# Altium schematic sheet Sensor.SchDoc: B502EA TH Sensor
size 292 x 193 mm; SheetNumber: 1; SheetTotal: 1
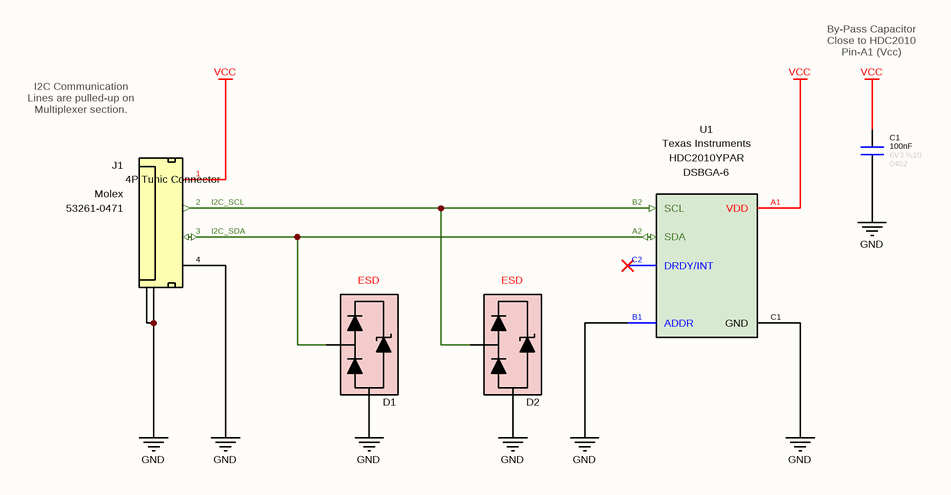
[diagram p0: Sensor.SchDoc]

## Parts
C1  value 100nF  Tolerance: %10  Voltage: 6V3  Case: 0402  [CAPACITOR_0402]  (hidden comment: Capacitor - 100nF [0402] (Ceramic))
D1  0402ESDA-MLP1  [ESD_0402]  (value not drawn)
D2  0402ESDA-MLP1  [ESD_0402]  (value not drawn)
J1  Manufacturer Name: Molex  Manufacturer Part Number: 53261-0471  [Connector_Tunic 4P]  (hidden comment: 4P SMD Tunic Connector)
U1  Manufacturer Name: Texas Instruments  Case: DSBGA-6  [HDC2010]  (hidden comment: HDC2010YPAR)

## Nets
GND: C1.1 D1.2(GND) D2.2(GND) J1.4(Pin-4) J1.5(GND) J1.6(GND) U1.B1(ADDR) U1.C1(GND)
VCC: C1.2 J1.1(Pin-1) U1.A1(VDD)
I2C_SCL: D2.1(I/O) J1.2(Pin-2) U1.B2(SCL)
I2C_SDA: D1.1(I/O) J1.3(Pin-3) U1.A2(SDA)

Not connected (* = marked no-connect by the designer): U1 C2(DRDY/INT)*

## Notes on the sheet
- I2C Communication Lines are pulled-up on Multiplexer section.
- By-Pass Capacitor
  Close to HDC2010
  Pin-A1 (Vcc)
- © 2021 All rights reserved.
  This document may not, in whole or in part, be copied, photocopied, reproduced, translated or converted to any electronic or machine readable from without prior written permission of Mehmet Günce Akkoyun.
  Engineer contact : akkoyun@me.com
- Property of
- Engineer :
- Date :
- Size :
- A4
- Time :
- Project :
- Page :
- /
- Customer :
- Product ID :
- Module ID :
- Version :
- File :
- Revision :
- (in symbol Connector - Mini Tunic 4P (1.25)) 4P Tunic Connector
- (in symbol Diode - TPD1E05U06DPYR) ESD

## Library data of the parts
C1 = Capacitor - 100nF [0402-6V3]: Capacitor - 100nF [0402-6V3] (Ceramic); Manufacturer Name: AVX; Manufacturer Part Number: 04026D104KAT4A; ComponentLink1Description: Mouser; ComponentLink1URL: https://www.mouser.com.tr/ProductDetail/AVX/04026D104KAT4A?qs=sGAEpiMZZMs0AnBnWHyRQPg4iYkCw7IMED%2F4kpqgf7w%3D; ComponentLink2Description: DataSheet; ComponentLink2URL: https://www.mouser.com.tr/datasheet/2/40/cx5r-776519.pdf
D1 D2 = Diode - TPD1E05U06DPYR: SUPPRESSOR ESD 30VDC 0402 HFREE; Manufacturer Name: Eaton; Breakdown Voltage: 30V; Capacitance: 0.15pF; Manufacturer Part Number: 0402ESDA-MLP1; Case: 0402
J1 = Connector - Mini Tunic 4P (1.25): Mini Tunic Connector with 4P; Pitch: 1.25mm; Position: 4; ROHS: Yes; ComponentLink1Description: DataSheet; ComponentLink1URL: https://www.mouser.com.tr/datasheet/2/276/0532610471_PCB_HEADERS-170942.pdf; ComponentLink2Description: Mouser; ComponentLink2URL: https://www.mouser.com.tr/ProductDetail/Molex/53261-0471?qs=%2Fha2pyFaduhLhIsk8tywtK7BwWtguBSP4XxyDBTOTfs%3D; Case: SMD
U1 = IC - HDC2010: GEN 2 HUMIDITY SENSOR; Product Type: T/H Sensor; Maximum Operating Temperature: + 85 C; Minimum Operating Temperature: - 40 C; Manufacturer Part Number: HDC2010YPAR